# Altium project MCU089B.PrjPcb (part 1 of 4)
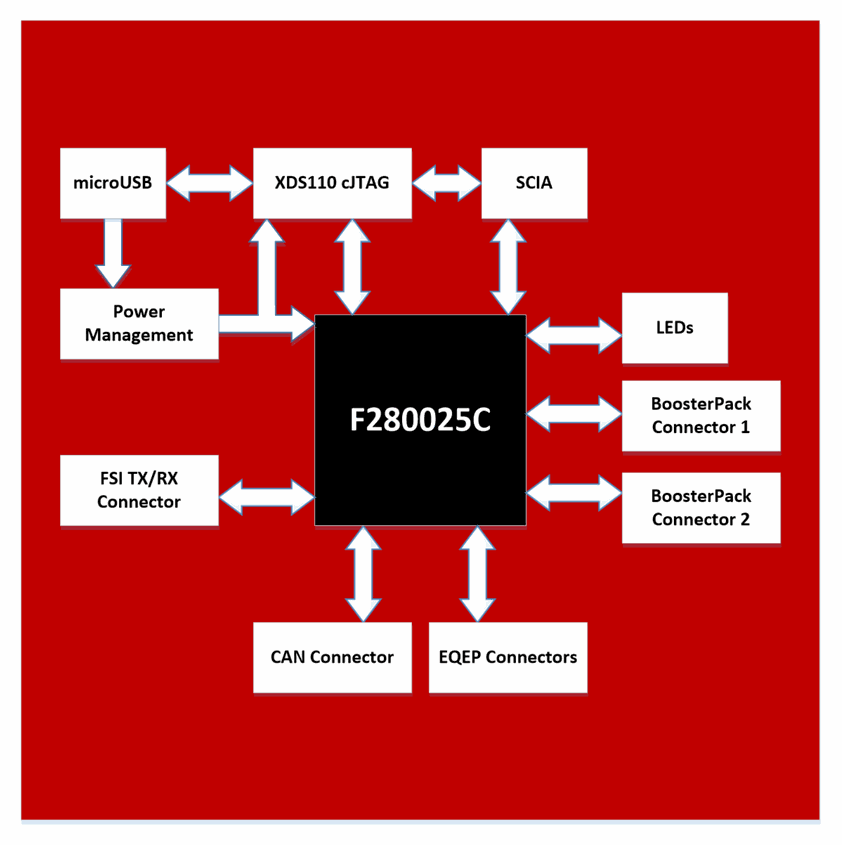
[diagram p0: MCU089B_Block_Diagram.SchDoc]
CopyrightYear: 2022; PCB_Layout: a0232540; PCB_Rev: B; PRJ_Customer: Public Release; PRJ_Engineer: Kevin Allen; PRJ_Number: MCU089; PRJ_Title: LAUNCHXL-F280025C; SCH_Rev: B; TechSupport: http://www.ti.com/support; TID: N/A
7 sheets, 262 parts. Net scope: global (net labels, ports and power ports of the same name join across sheets).
Board file: MCU089B.PcbDoc
Sheets:
  MCU089B_Block_Diagram.SchDoc
  MCU089B_Connectors.SchDoc
  MCU089B_AltRouting_Misc.SchDoc
  MCU089B_F280025C_Device.SchDoc
  MCU089B_XDS110_USB_Power.SchDoc
  MCU089B_XDS110_MCU.SchDoc
  MCU089B_Hardware.SchDoc

## Sheet MCU089B_Block_Diagram.SchDoc
size 431 x 279 mm; Date: Not shown in title block; ApprovedBy: Not shown in title block; CheckedBy: Not shown in title block; Author: Not shown in title block; CompanyName: Not shown in title block; Engineer: Not shown in title block; Organization: Not shown in title block; Address1: Not shown in title block; Address2: Not shown in title block; Address3: Not shown in title block; Address4: Not shown in title block; DocumentNumber: 1; Revision: Use project parameter SCH_Rev; SheetNumber: 1; SheetTotal: 8; PageSetup: Record=PageOptions|CenterHorizontal=True|CenterVertical=True|PrintScale=1.00|XCorrection=1.00|YCorrection=1.00|PrintKind=0|BorderSize=5000000|LeftOffset=0|BottomOffset=0|Orientation=2|PaperLength=1000|PaperWidth=1000|Scale=100|PaperSource=15|PrintQuality=600|MediaType=1|DitherType=10|PaperKind=Letter|PrintScaleMode=1; CurrentTime: Not shown in title block; CurrentDate: Not shown in title block; Time: Not shown in title block; DocumentFullPathAndName: Not shown in title block; DocumentName: Not shown in title block; ModifiedDate: Not shown in title block; ImagePath: Not shown in title block

### Notes on the sheet
- Drawn By:
- SVN Rev:
- Number:
- TID #:
- Orderable:
- Rev:
- Sheet Title:
- File:
- Project Title:
- Designed for:
- Assembly Variant:
- Mod. Date:
- Sheet:
- Size:
- of
- B
- http://www.ti.com
- Texas Instruments and/or its licensors do not warrant the accuracy or completeness of this specification or any information contained therein. Texas Instruments and/or its licensors do not warrant that this design will meet the specifications, will be suitable for your application or fit for any particular purpose, or will operate in an implementation. Texas Instruments and/or its licensors do not warrant that the design is production worthy. You should completely validate and test your design implementation to confirm the system functionality for your application.
- Engineer:
- Contact:
- © Texas Instruments

## Sheet MCU089B_Connectors.SchDoc
size 431 x 279 mm; Date: Not shown in title block; ApprovedBy: Not shown in title block; CheckedBy: Not shown in title block; Author: Not shown in title block; CompanyName: Not shown in title block; Engineer: Not shown in title block; Organization: Not shown in title block; Address1: Not shown in title block; Address2: Not shown in title block; Address3: Not shown in title block; Address4: Not shown in title block; DocumentNumber: 2; Revision: Use project parameter SCH_Rev; SheetNumber: 2; SheetTotal: 8; PageSetup: Record=PageOptions|CenterHorizontal=True|CenterVertical=True|PrintScale=1.00|XCorrection=1.00|YCorrection=1.00|PrintKind=0|BorderSize=5000000|LeftOffset=0|BottomOffset=0|Orientation=2|PaperLength=1000|PaperWidth=1000|Scale=100|PaperSource=15|PrintQuality=600|MediaType=1|DitherType=10|PaperKind=Letter|PrintScaleMode=1; CurrentTime: Not shown in title block; CurrentDate: Not shown in title block; Time: Not shown in title block; DocumentFullPathAndName: Not shown in title block; DocumentName: Not shown in title block; ModifiedDate: Not shown in title block; ImagePath: Not shown in title block
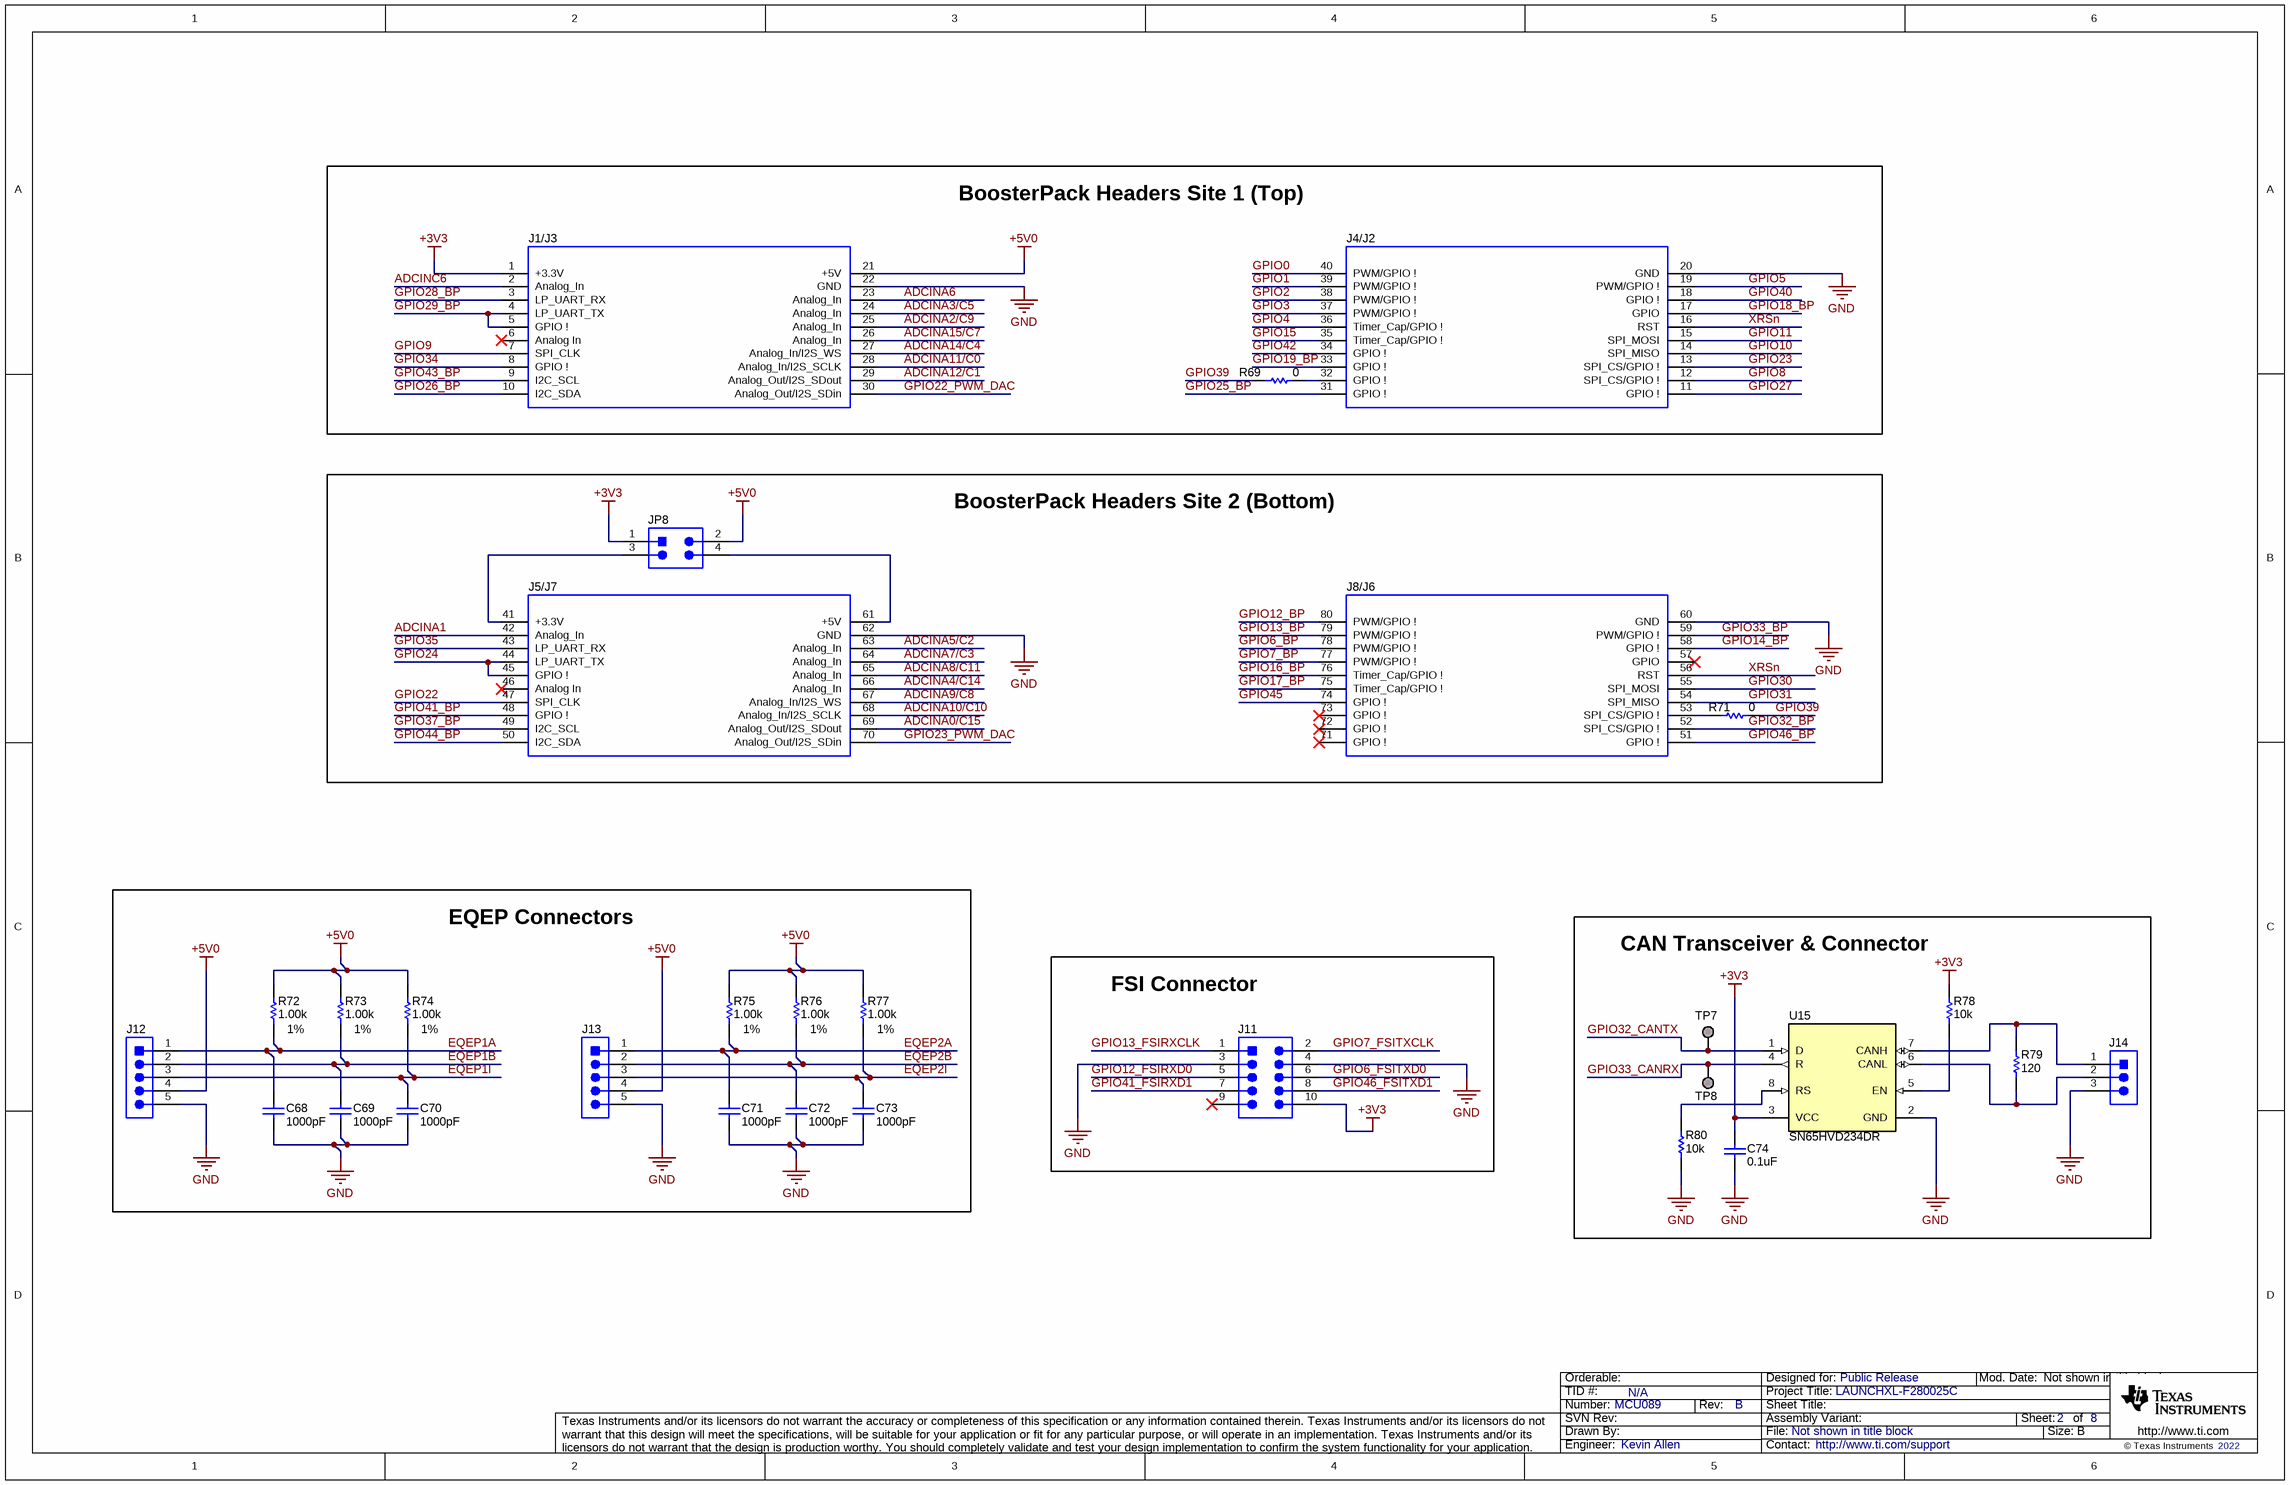
[diagram p1: MCU089B_Connectors.SchDoc]

### Parts
C68  ValueDisplayed: 1000pF  [0402]  (hidden comment: 885012205061)
C69  ValueDisplayed: 1000pF  [0402]  (hidden comment: 885012205061)
C70  ValueDisplayed: 1000pF  [0402]  (hidden comment: 885012205061)
C71  ValueDisplayed: 1000pF  [0402]  (hidden comment: 885012205061)
C72  ValueDisplayed: 1000pF  [0402]  (hidden comment: 885012205061)
C73  ValueDisplayed: 1000pF  [0402]  (hidden comment: 885012205061)
C74  ValueDisplayed: 0.1uF  [0402]  (hidden comment: GRM155R71A104KA01D)
J1/J3  SSQ-110-03-T-D  [BoosterPack_40pin_J1J3]  (value not drawn)
J4/J2  SSQ-110-03-T-D  [BoosterPack_40pin_J2J4]  (value not drawn)
J5/J7  SSQ-110-03-T-D  [BoosterPack_40pin_J5J7]  (value not drawn)
J8/J6  SSQ-110-03-T-D  [BoosterPack_40pin_J6J8]  (value not drawn)
J11  TSW-105-07-G-D  [TSW-105-07-G-D]  (value not drawn)
J12  TSW-105-07-G-S  [TSW-105-07-X-S]  (value not drawn)
J13  TSW-105-07-G-S  [TSW-105-07-X-S]  (value not drawn)
J14  61300311121  [WURTH_61300311121]  (value not drawn)
JP8  TSW-102-07-G-D  [TSW-102-07-G-D]  (value not drawn)
R69  ValueDisplayed: 0  [0603]  (hidden comment: CRCW06030000Z0EA)
R71  ValueDisplayed: 0  [0603]  (hidden comment: CRCW06030000Z0EA)
R72  ValueDisplayed: 1.00k  Value1: 1%  [0402]  (hidden comment: CRCW04021K00FKED)
R73  ValueDisplayed: 1.00k  Value1: 1%  [0402]  (hidden comment: CRCW04021K00FKED)
R74  ValueDisplayed: 1.00k  Value1: 1%  [0402]  (hidden comment: CRCW04021K00FKED)
R75  ValueDisplayed: 1.00k  Value1: 1%  [0402]  (hidden comment: CRCW04021K00FKED)
R76  ValueDisplayed: 1.00k  Value1: 1%  [0402]  (hidden comment: CRCW04021K00FKED)
R77  ValueDisplayed: 1.00k  Value1: 1%  [0402]  (hidden comment: CRCW04021K00FKED)
R78  ValueDisplayed: 10k  [0402]  (hidden comment: CRCW040210K0JNED)
R79  ValueDisplayed: 120  [0603]  (hidden comment: RC0603FR-07120RL)
R80  ValueDisplayed: 10k  [0402]  (hidden comment: CRCW040210K0JNED)
TP7  TESTPOINT  [TP_50MIL-25MILHOLE]  (value not drawn)  (no BOM)
TP8  TESTPOINT  [TP_50MIL-25MILHOLE]  (value not drawn)  (no BOM)
U15  SN65HVD234DR  [D0008A_L]

### Blocks framed on the sheet
BoosterPack Headers Site 1 (Top): J1/J3 J4/J2 R69
BoosterPack Headers Site 2 (Bottom): J5/J7 J8/J6 JP8 R71
EQEP Connectors: C68-C73 J12 J13 R72-R77
FSI Connector: J11
CAN Transceiver & Connector: C74 J14 R78-R80 TP7 TP8 U15

### Nets
+3V3: C74.2 J1/J3.1(+3.3V) J11.10 JP8.1 R78.2 U15.3(VCC)
+5V0: J1/J3.21(+5V) J12.4 J13.4 JP8.2 R72.2 R73.2 R74.2 R75.2 R76.2 R77.2
GND: C68.2 C69.2 C70.2 C71.2 C72.2 C73.2 C74.1 J1/J3.22(GND) J4/J2.20(GND) J5/J7.62(GND) J8/J6.60(GND) J11.3 J11.4 J12.5 J13.5 J14.3 R80.1 U15.2(GND)
ADCINA0/C15: J5/J7.69(Analog_Out/I2S_SDout)
ADCINA1: J5/J7.42(Analog_In)
ADCINA2/C9: J1/J3.25(Analog_In)
ADCINA3/C5: J1/J3.24(Analog_In)
ADCINA4/C14: J5/J7.66(Analog_In)
ADCINA5/C2: J5/J7.63(Analog_In)
ADCINA6: J1/J3.23(Analog_In)
ADCINA7/C3: J5/J7.64(Analog_In)
ADCINA8/C11: J5/J7.65(Analog_In)
ADCINA9/C8: J5/J7.67(Analog_In/I2S_WS)
ADCINA10/C10: J5/J7.68(Analog_In/I2S_SCLK)
ADCINA11/C0: J1/J3.28(Analog_In/I2S_SCLK)
ADCINA12/C1: J1/J3.29(Analog_Out/I2S_SDout)
ADCINA14/C4: J1/J3.27(Analog_In/I2S_WS)
ADCINA15/C7: J1/J3.26(Analog_In)
ADCINC6: J1/J3.2(Analog_In)
EQEP1A: C68.1 J12.1 R72.1
EQEP1B: C69.1 J12.2 R73.1
EQEP1I: C70.1 J12.3 R74.1
EQEP2A: C71.1 J13.1 R75.1
EQEP2B: C72.1 J13.2 R76.1
EQEP2I: C73.1 J13.3 R77.1
GPIO0: J4/J2.40(PWM/GPIO_!)
GPIO1: J4/J2.39(PWM/GPIO_!)
GPIO2: J4/J2.38(PWM/GPIO_!)
GPIO3: J4/J2.37(PWM/GPIO_!)
GPIO4: J4/J2.36(Timer_Cap/GPIO_!)
GPIO5: J4/J2.19(PWM/GPIO_!)
GPIO6_BP: J8/J6.78(PWM/GPIO_!)
GPIO6_FSITXD0: J11.6
GPIO7_BP: J8/J6.77(PWM/GPIO_!)
GPIO7_FSITXCLK: J11.2
GPIO8: J4/J2.12(SPI_CS/GPIO_!)
GPIO9: J1/J3.7(SPI_CLK)
GPIO10: J4/J2.14(SPI_MISO)
GPIO11: J4/J2.15(SPI_MOSI)
GPIO12_BP: J8/J6.80(PWM/GPIO_!)
GPIO12_FSIRXD0: J11.5
GPIO13_BP: J8/J6.79(PWM/GPIO_!)
GPIO13_FSIRXCLK: J11.1
GPIO14_BP: J8/J6.58(GPIO_!)
GPIO15: J4/J2.35(Timer_Cap/GPIO_!)
GPIO16_BP: J8/J6.76(Timer_Cap/GPIO_!)
GPIO17_BP: J8/J6.75(Timer_Cap/GPIO_!)
GPIO18_BP: J4/J2.17(GPIO)
GPIO19_BP: J4/J2.33(GPIO_!)
GPIO22: J5/J7.47(SPI_CLK)
GPIO22_PWM_DAC: J1/J3.30(Analog_Out/I2S_SDin)
GPIO23: J4/J2.13(SPI_CS/GPIO_!)
GPIO23_PWM_DAC: J5/J7.70(Analog_Out/I2S_SDin)
GPIO24: J5/J7.44(LP_UART_TX) J5/J7.45(GPIO_!)
GPIO25_BP: J4/J2.31(GPIO_!)
GPIO26_BP: J1/J3.10(I2C_SDA)
GPIO27: J4/J2.11(GPIO_!)
GPIO28_BP: J1/J3.3(LP_UART_RX)
GPIO29_BP: J1/J3.4(LP_UART_TX) J1/J3.5(GPIO_!)
GPIO30: J8/J6.55(SPI_MOSI)
GPIO31: J8/J6.54(SPI_MISO)
GPIO32_BP: J8/J6.52(SPI_CS/GPIO_!)
GPIO32_CANTX: TP7.1 U15.1(D)
GPIO33_BP: J8/J6.59(PWM/GPIO_!)
GPIO33_CANRX: TP8.1 U15.4(R)
GPIO34: J1/J3.8(GPIO_!)
GPIO35: J5/J7.43(LP_UART_RX)
GPIO37_BP: J5/J7.49(I2C_SCL)
GPIO39: R69.1 R71.2
GPIO40: J4/J2.18(GPIO_!)
GPIO41_BP: J5/J7.48(GPIO_!)
GPIO41_FSIRXD1: J11.7
GPIO42: J4/J2.34(GPIO_!)
GPIO43_BP: J1/J3.9(I2C_SCL)
GPIO44_BP: J5/J7.50(I2C_SDA)
GPIO45: J8/J6.74(GPIO_!)
GPIO46_BP: J8/J6.51(GPIO_!)
GPIO46_FSITXD1: J11.8
XRSn: J4/J2.16(RST) J8/J6.56(RST)
NetJ4/J2_32: J4/J2.32(GPIO_!) R69.2
NetJ5/J7_41: J5/J7.41(+3.3V) JP8.3
NetJ5/J7_61: J5/J7.61(+5V) JP8.4
NetJ8/J6_53: J8/J6.53(SPI_CS/GPIO_!) R71.1
NetJ14_1: J14.1 R79.2 U15.7(CANH)
NetJ14_2: J14.2 R79.1 U15.6(CANL)
NetR78_1: R78.1 U15.5(EN)
NetR80_2: R80.2 U15.8(RS)

Not connected (* = marked no-connect by the designer): J1/J3 6(Analog_In)*; J5/J7 46(Analog_In)*; J8/J6 57(GPIO)* 71(GPIO_!)* 72(GPIO_!)* 73(GPIO_!)*; J11 9*

### Notes on the sheet
- Drawn By:
- SVN Rev:
- Number:
- TID #:
- Orderable:
- Rev:
- Sheet Title:
- File:
- Project Title:
- Designed for:
- Assembly Variant:
- Mod. Date:
- Sheet:
- Size:
- of
- B
- http://www.ti.com
- Texas Instruments and/or its licensors do not warrant the accuracy or completeness of this specification or any information contained therein. Texas Instruments and/or its licensors do not warrant that this design will meet the specifications, will be suitable for your application or fit for any particular purpose, or will operate in an implementation. Texas Instruments and/or its licensors do not warrant that the design is production worthy. You should completely validate and test your design implementation to confirm the system functionality for your application.
- Engineer:
- Contact:
- © Texas Instruments

### Library data of the parts
C68-C73 = CMP-0006231-2: CAP, CERM, 1000 pF, 50 V, +/- 10%, X7R, 0402; Manufacturer: Wurth Elektronik; Polarized: N; Value: 1000pF; U/M: EA; Cap_F: 1nF; Value1: Unknown; VDC_V: 50V; TaMin_C: -55°C; TaMax_C: 125°C; SizeArea_mm2: 0.5; SizeAreaWB_mm2: 3; SizeX_mm: 1; SizeZ_mm: 0.6; AEC Category: Q200; CompType: Capacitor; PartNumber: 885012205061; PackageReference: 0402; RoHS: Y; Tolerance_%: 10%; Value2: 50V; MountType: SMT; Technology: Ceramic; TempCo: X7R; Cap_Case: 0402; SizeY_mm: 0.5; Published: 2008-06-19; Publisher: Texas Instruments; LatestRevisionDate: 2017-03-09; ComponentLink1Description: Datasheet link; ComponentLink1URL: http://katalog.we-online.de/pbs/datasheet/885012205061.pdf; Supplier 1: Digi-Key; Supplier Part Number 1: 732-7556-1-ND; Supplier 2: Mouser; Supplier Part Number 2: 710-885012205061; AEC Qualified: N; AEC Grade: N/A
C74 = CMP-0006629-2: CAP, CERM, 0.1 uF, 10 V, +/- 10%, X7R, 0402; Manufacturer: MuRata; Polarized: N; Value: 0.1uF; U/M: EA; Cap_F: 100nF; Value1: Unknown; VDC_V: 10V; TaMin_C: -55°C; TaMax_C: 125°C; SizeArea_mm2: 0.5; SizeAreaWB_mm2: 3; SizeX_mm: 1; SizeZ_mm: 0.6; AEC Category: Q200; CompType: Capacitor; PartNumber: GRM155R71A104KA01D; PackageReference: 0402; RoHS: Y; Tolerance_%: 10%; Value2: 10V; MountType: SMT; Technology: Ceramic; TempCo: X7R; Cap_Case: 0402; SizeY_mm: 0.5; Published: 2008-06-19; Publisher: Texas Instruments; LatestRevisionDate: 2017-03-09; ComponentLink1Description: Datasheet link; ComponentLink1URL: http://search.murata.co.jp/Ceramy/PnsearchViewAction.do?HnOFG=ON&HnNFG=ON&SEL_CNT=50&sLang=en&sKey=GRM155R71A104KA01D&x=9&y=9&search=startwith; Supplier 1: Digi-Key; Supplier Part Number 1: GRM155R71A104KA01D-ND; Supplier 2: Newark; Supplier Part Number 2: 14T3278; Supplier 3: Mouser; Supplier Part Number 3: 81-GRM155R71A104KA1D; AEC Qualified: ?
J1/J3 = CMP-0003837-4: Receptacle, 2.54mm, 10x2, Tin, TH; Alternate PartNumber: CRD-081413-A-G; Manufacturer: Samtec; Alternate Manufacturer: Major League Electronics; Note: Booster Pack 40 pin J1 and J3; Green_Lifecycle: Active; Green_REACh: Incomplete; Supplier 1: Digi-Key; CompType: Receptacle; PackageReference: 10x2 Receptacle; RoHS: Y; Supplier Part Number 1: SAM1204-10-ND; MountType: TH; PartNumber: SSQ-110-03-T-D; ComponentLink1Description: Datasheet Link; ComponentLink1URL: https://www.samtec.com/ftppub/cpdf/SSQ-1XX-XX-XXX-X-XX-XXX-XX-X-MKT.pdf; Supplier 2: Newark; Supplier Part Number 2: 11P8392; Green_EU RoHS: Passed; Green_EU RoHS-2: Passed
J4/J2 = CMP-0078266-4: Receptacle, 2.54mm, 10x2, Tin, TH; Alternate PartNumber: CRD-081413-A-G; Manufacturer: Samtec; Alternate Manufacturer: Major League Electronics; Note: Booster Pack 40 pin J2 and J4; Green_REACh: Incomplete; Green_Lifecycle: Active; Green_EU RoHS-2: Passed; CompType: Receptacle; Supplier 1: Digi-Key; PackageReference: 10x2 Receptacle; RoHS: Y; Supplier Part Number 1: SAM1204-10-ND; PartNumber: SSQ-110-03-T-D; MountType: TH; ComponentLink1Description: Datasheet Link; Green_EU RoHS: Passed; ComponentLink1URL: https://www.samtec.com/ftppub/cpdf/SSQ-1XX-XX-XXX-X-XX-XXX-XX-X-MKT.pdf; Supplier 2: Newark; Supplier Part Number 2: 11P8392
J5/J7 = CMP-0081070-3: Receptacle, 2.54mm, 10x2, Tin, TH; Alternate PartNumber: CRD-081413-A-G; Manufacturer: Samtec; Alternate Manufacturer: Major League Electronics; Note: Booster Pack 40 pin J5 and J7; Green_REACh: Incomplete; Green_Lifecycle: Active; ComponentLink1URL: https://www.samtec.com/ftppub/cpdf/SSQ-1XX-XX-XXX-X-XX-XXX-XX-X-MKT.pdf; Green_EU RoHS-2: Passed; CompType: Receptacle; Supplier 1: Digi-Key; PackageReference: 10x2 Receptacle; RoHS: Y; Supplier Part Number 1: SAM1204-10-ND; PartNumber: SSQ-110-03-T-D; MountType: TH; ComponentLink1Description: Datasheet Link; Green_EU RoHS: Passed
J8/J6 = CMP-0081071-3: Receptacle, 2.54mm, 10x2, Tin, TH; Alternate PartNumber: CRD-081413-A-G; Manufacturer: Samtec; Alternate Manufacturer: Major League Electronics; Note: Booster Pack 40 pin J6 and J8; Green_REACh: Incomplete; Green_Lifecycle: Active; ComponentLink1URL: https://www.samtec.com/ftppub/cpdf/SSQ-1XX-XX-XXX-X-XX-XXX-XX-X-MKT.pdf; Green_EU RoHS-2: Passed; CompType: Receptacle; Supplier 1: Digi-Key; PackageReference: 10x2 Receptacle; RoHS: Y; Supplier Part Number 1: SAM1204-10-ND; PartNumber: SSQ-110-03-T-D; MountType: TH; ComponentLink1Description: Datasheet Link; Green_EU RoHS: Passed
J11 = CMP-0075410-2: Header, 100mil, 5x2, Gold, TH; Manufacturer: Samtec; Pitch_mm: 2.54; Cert_VDE: N; Gender: Male; Cert_CSA: Y; Voltage_V: 550V; Green_REACh: Passed; Current_A: 6.3A; Green_Lifecycle: Active; Row_Count: 2; ComponentLink1Description: Datasheet URL; RoHS: Y; Supplier 1: Digi-Key; Cert_UL: Y; Orientation: Vertical; Green_EU RoHS: Passed; PackageReference: 5x2 Header; Color: Black; PartNumber: TSW-105-07-G-D; PinCount: 10; ContactFinish: Gold; Cert_CULUS: N; Shrouded: N; ClassName: Header; RowSpacing_mm: 2.54; ComponentLink1URL: http://samtec.com/ftppub/pdf/TSW_TH.PDF; CompType: Header; MountType: TH; Supplier Part Number 1: SAM1028-05-ND; Green_EU RoHS-2: Passed
J12 J13 = CMP-0075411-1: Header, 100mil, 5x1, Gold, TH; Manufacturer: Samtec; Pitch_mm: 2.54; Cert_VDE: N; Gender: Male; Cert_CSA: Y; Voltage_V: 550V; Green_REACh: Passed; Current_A: 6.3A; CT: False; Green_Lifecycle: Active; Row_Count: 1; CNHeader: True; ComponentLink1Description: Datasheet URL; RoHS: Y; Supplier 1: Digi-Key; Cert_UL: Y; Orientation: Vertical; Green_EU RoHS: Passed; PackageReference: 5x1 Header; Color: Black; PartNumber: TSW-105-07-G-S; PinCount: 5; Publisher: Texas Instruments; ContactFinish: Gold; Cert_CULUS: N; Shrouded: N; ClassName: Header; ComponentLink1URL: http://samtec.com/ftppub/pdf/TSW_TH.PDF; LatestRevisionDate: 2017-07-12; CompType: Header; MountType: TH; Supplier Part Number 1: SAM1029-05-ND; Green_EU RoHS-2: Passed
J14 = CMP-0054796-1: Header, 2.54 mm, 3x1, Gold, TH; Manufacturer: Wurth Elektronik; Green_Lifecycle: Active; Green_REACh: Passed; CNHeader: TRUE; CT: FALSE; PartNumber: 61300311121; PackageReference: Header, 2.54mm, 3x1, TH; ClassName: Header; CompType: Header; RoHS: Y; MountType: TH; ComponentLink1Description: Datasheet URL; ComponentLink1URL: http://katalog.we-online.de/em/datasheet/6130xx11121.pdf; Publisher: Texas Instruments; LatestRevisionDate: 26/05/2017; Supplier 1: Digi-Key; Supplier Part Number 1: 732-5316-ND; Supplier 2: Newark; Supplier Part Number 2: 20X0950; Supplier 3: Farnell; Supplier Part Number 3: 356154; Green_EU RoHS: Passed; Green_EU RoHS-2: Incomplete
JP8 = CMP-0075404-1: Header, 100mil, 2x2, Gold, TH; Manufacturer: Samtec; CNHeader: True; Shrouded: N; Gender: Male; Row_Count: 2; RowSpacing_mm: 2.54; CT: False; Cert_CSA: Y; Current_A: 6.3A; Green_Lifecycle: Active; Green_REACh: Passed; Voltage_V: 550V; ComponentLink1URL: http://samtec.com/ftppub/pdf/TSW_TH.PDF; ClassName: Header; Publisher: Texas Instruments; Color: Black; RoHS: Y; MountType: TH; Supplier 1: Digi-Key; PackageReference: 2x2 Header; PinCount: 4; CompType: Header; LatestRevisionDate: 2017-07-12; PartNumber: TSW-102-07-G-D; Orientation: Vertical; ComponentLink1Description: Datasheet URL; Supplier Part Number 1: SAM1028-02-ND; Pitch_mm: 2.54; ContactFinish: Gold; Cert_CULUS: N; Cert_UL: Y; Cert_VDE: N; Green_EU RoHS: Passed; Green_EU RoHS-2: Passed
R69 R71 = CMP-0025697-4: RES, 0, 5%, 0.1 W, AEC-Q200 Grade 0, 0603; Manufacturer: Vishay-Dale; Value: 0; Value_Code: 0000; Power_W: 100mW; Value2: 0.1W; VDC_V: 75V; TempCo: 200 ppm/C; SizeArea_mm2: 1.28; SizeX_mm: 1.6; SizeY_mm: 0.8; SizeZ_mm: 1; EIA_Code: E24; AEC Category: Q200; AEC Qualified: Y; CompType: Resistor; PartNumber: CRCW06030000Z0EA; PackageReference: 0603; RoHS: E; Res_ohm: 0; Tolerance_%: 5%; Value1: 5%; MountType: SMT; Technology: Thick Film; ComponentLink1Description: Datasheet link; ComponentLink1URL: http://www.vishay.com/docs/20035/dcrcwe3.pdf; Supplier 1: Digi-Key; Supplier Part Number 1: 541-0.0GCT-ND; Supplier 2: Newark; Supplier Part Number 2: 52K8014; Supplier 3: Mouser; Supplier Part Number 3: 71-CRCW0603-0-E3; AEC Grade: 0
R72-R77 = CMP-0026071-3: RES, 1.00 k, 1%, 0.063 W, AEC-Q200 Grade 0, 0402; Manufacturer: Vishay-Dale; Value: 1.00k; Res_ohm: 1k; Value_Code: 1k00; Power_W: 63mW; Value2: 0.063W; VDC_V: 50V; TempCo: 100 ppm/C; SizeArea_mm2: 0.5; SizeX_mm: 1; SizeZ_mm: 0.6; EIA_Code: E96; AEC Category: Q200; AEC Qualified: Y; AEC Grade: 0; CompType: Resistor; PartNumber: CRCW04021K00FKED; PackageReference: 0402; RoHS: E; Tolerance_%: 1%; MountType: SMT; Technology: Thick Film; SizeY_mm: 0.5; ComponentLink1Description: Datasheet link; ComponentLink1URL: http://www.vishay.com/docs/20035/dcrcwe3.pdf; Supplier 1: Digi-Key; Supplier Part Number 1: 541-1.00KLCT-ND; Supplier 2: Newark; Supplier Part Number 2: 52K6545; Supplier 3: Mouser; Supplier Part Number 3: 71-CRCW0402-1.0K-E3
R78 R80 = CMP-0026825-5: RES, 10 k, 5%, 0.063 W, AEC-Q200 Grade 0, 0402; Manufacturer: Vishay-Dale; Value: 10k; Value_Code: 10k0; Power_W: 63mW; Value2: 0.063W; VDC_V: 50V; TempCo: 200 ppm/C; SizeArea_mm2: 0.5; SizeX_mm: 1; SizeZ_mm: 0.6; EIA_Code: E24; AEC Category: Q200; AEC Qualified: Y; AEC Grade: 0; CompType: Resistor; PartNumber: CRCW040210K0JNED; PackageReference: 0402; RoHS: E; Res_ohm: 10k; Tolerance_%: 5%; Value1: 5%; MountType: SMT; Technology: Thick Film; SizeY_mm: 0.5; ComponentLink1Description: Datasheet link; ComponentLink1URL: http://www.vishay.com/docs/20035/dcrcwe3.pdf; Supplier 1: Digi-Key; Supplier Part Number 1: 541-10KJCT-ND; Supplier 2: Newark; Supplier Part Number 2: 59M6696; Supplier 3: Mouser; Supplier Part Number 3: 71-CRCW0402J-10K-E3
R79 = CMP-0022769-3: RES, 120, 1%, 0.1 W, 0603; Manufacturer: Yageo America; Value: 120; Value_Code: 120R; Power_W: 100mW; Value2: 0.1W; VDC_V: 150V; TempCo: 200 ppm/C; SizeArea_mm2: 1.28; SizeX_mm: 1.6; SizeY_mm: 0.8; SizeZ_mm: 1; U/M: EA; AEC Category: Q200; CompType: Resistor; PartNumber: RC0603FR-07120RL; PackageReference: 0603; RoHS: Y; Res_ohm: 120; Tolerance_%: 1%; Value1: 1%; MountType: SMT; Technology: Thick Film; Published: 2008-06-26; Publisher: Texas Instruments; LatestRevisionDate: 2017-03-09; ComponentLink1Description: Datasheet link; ComponentLink1URL: http://www.yageo.com/pdf/Pu-RC0603_51_PbFree_L_2.pdf; Supplier 1: Digi-Key; Supplier Part Number 1: 311-120HRCT-ND; Supplier 2: Mouser; Supplier Part Number 2: 603-RC0603FR-07120RL; Supplier 3: Farnell; Supplier Part Number 3: 9238379; AEC Qualified: ?
TP7 TP8 = CMP-0078143-3: TEST POINT.  No entry in BOM.; CompType: Testpoint; PackageReference: N/A; Manufacturer: N/A; PartNumber: N/A; Library Reference: TESTPOINT
U15 = CMP-0033355-1: 3.3V CAN Transceiver with Sleep Mode, 6 mA, -40 to 125 degC, 8-pin SOIC (D), Green (RoHS & no Sb/Br); Manufacturer: Texas Instruments; Drivers Per Package: 1; Bus Fault Voltage(V): +/-30; Transient Pulse Protection(V): -100 to 100; ICC(Max)(mA): 6; Supply Voltage(s)(V): 3.3; Rating: Catalog; DatasheetVersion: SLLS557F; PackageVersion: revM, Jun-2011; PackageReference: D0008A; PackageDescription: 8-Pin Plastic Small Outline Integrated Circuit, 4.9 x 3.9 mm, Pitch 1.27 mm Pitch; Eco-Plan: Green (RoHS & no Sb/Br); SubFamily: CAN; Receivers Per Package: 1; Isolated: No; Low Power Mode: Sleep; Footprint: PCA82C250, excludes pin5; PartNumber: SN65HVD234DR; Code_JEDEC: MS-012AA; ComponentLink1Description: Datasheet; ComponentLink1URL: http://www.ti.com/general/docs/lit/getliterature.tsp?genericPartNumber=SN65HVD234&fileType=pdf; Mounting Technology: Surface Mount

## Sheet MCU089B_AltRouting_Misc.SchDoc
size 431 x 279 mm; Date: Not shown in title block; ApprovedBy: Not shown in title block; CheckedBy: Not shown in title block; Author: Not shown in title block; CompanyName: Not shown in title block; Engineer: Not shown in title block; Organization: Not shown in title block; Address1: Not shown in title block; Address2: Not shown in title block; Address3: Not shown in title block; Address4: Not shown in title block; DocumentNumber: 3; Revision: Use project parameter SCH_Rev; SheetNumber: 3; SheetTotal: 8; PageSetup: Record=PageOptions|CenterHorizontal=True|CenterVertical=True|PrintScale=1.00|XCorrection=1.00|YCorrection=1.00|PrintKind=0|BorderSize=5000000|LeftOffset=0|BottomOffset=0|Orientation=2|PaperLength=1000|PaperWidth=1000|Scale=100|PaperSource=15|PrintQuality=600|MediaType=1|DitherType=10|PaperKind=Letter|PrintScaleMode=1; CurrentTime: Not shown in title block; CurrentDate: Not shown in title block; Time: Not shown in title block; DocumentFullPathAndName: Not shown in title block; DocumentName: Not shown in title block; ModifiedDate: Not shown in title block; ImagePath: Not shown in title block
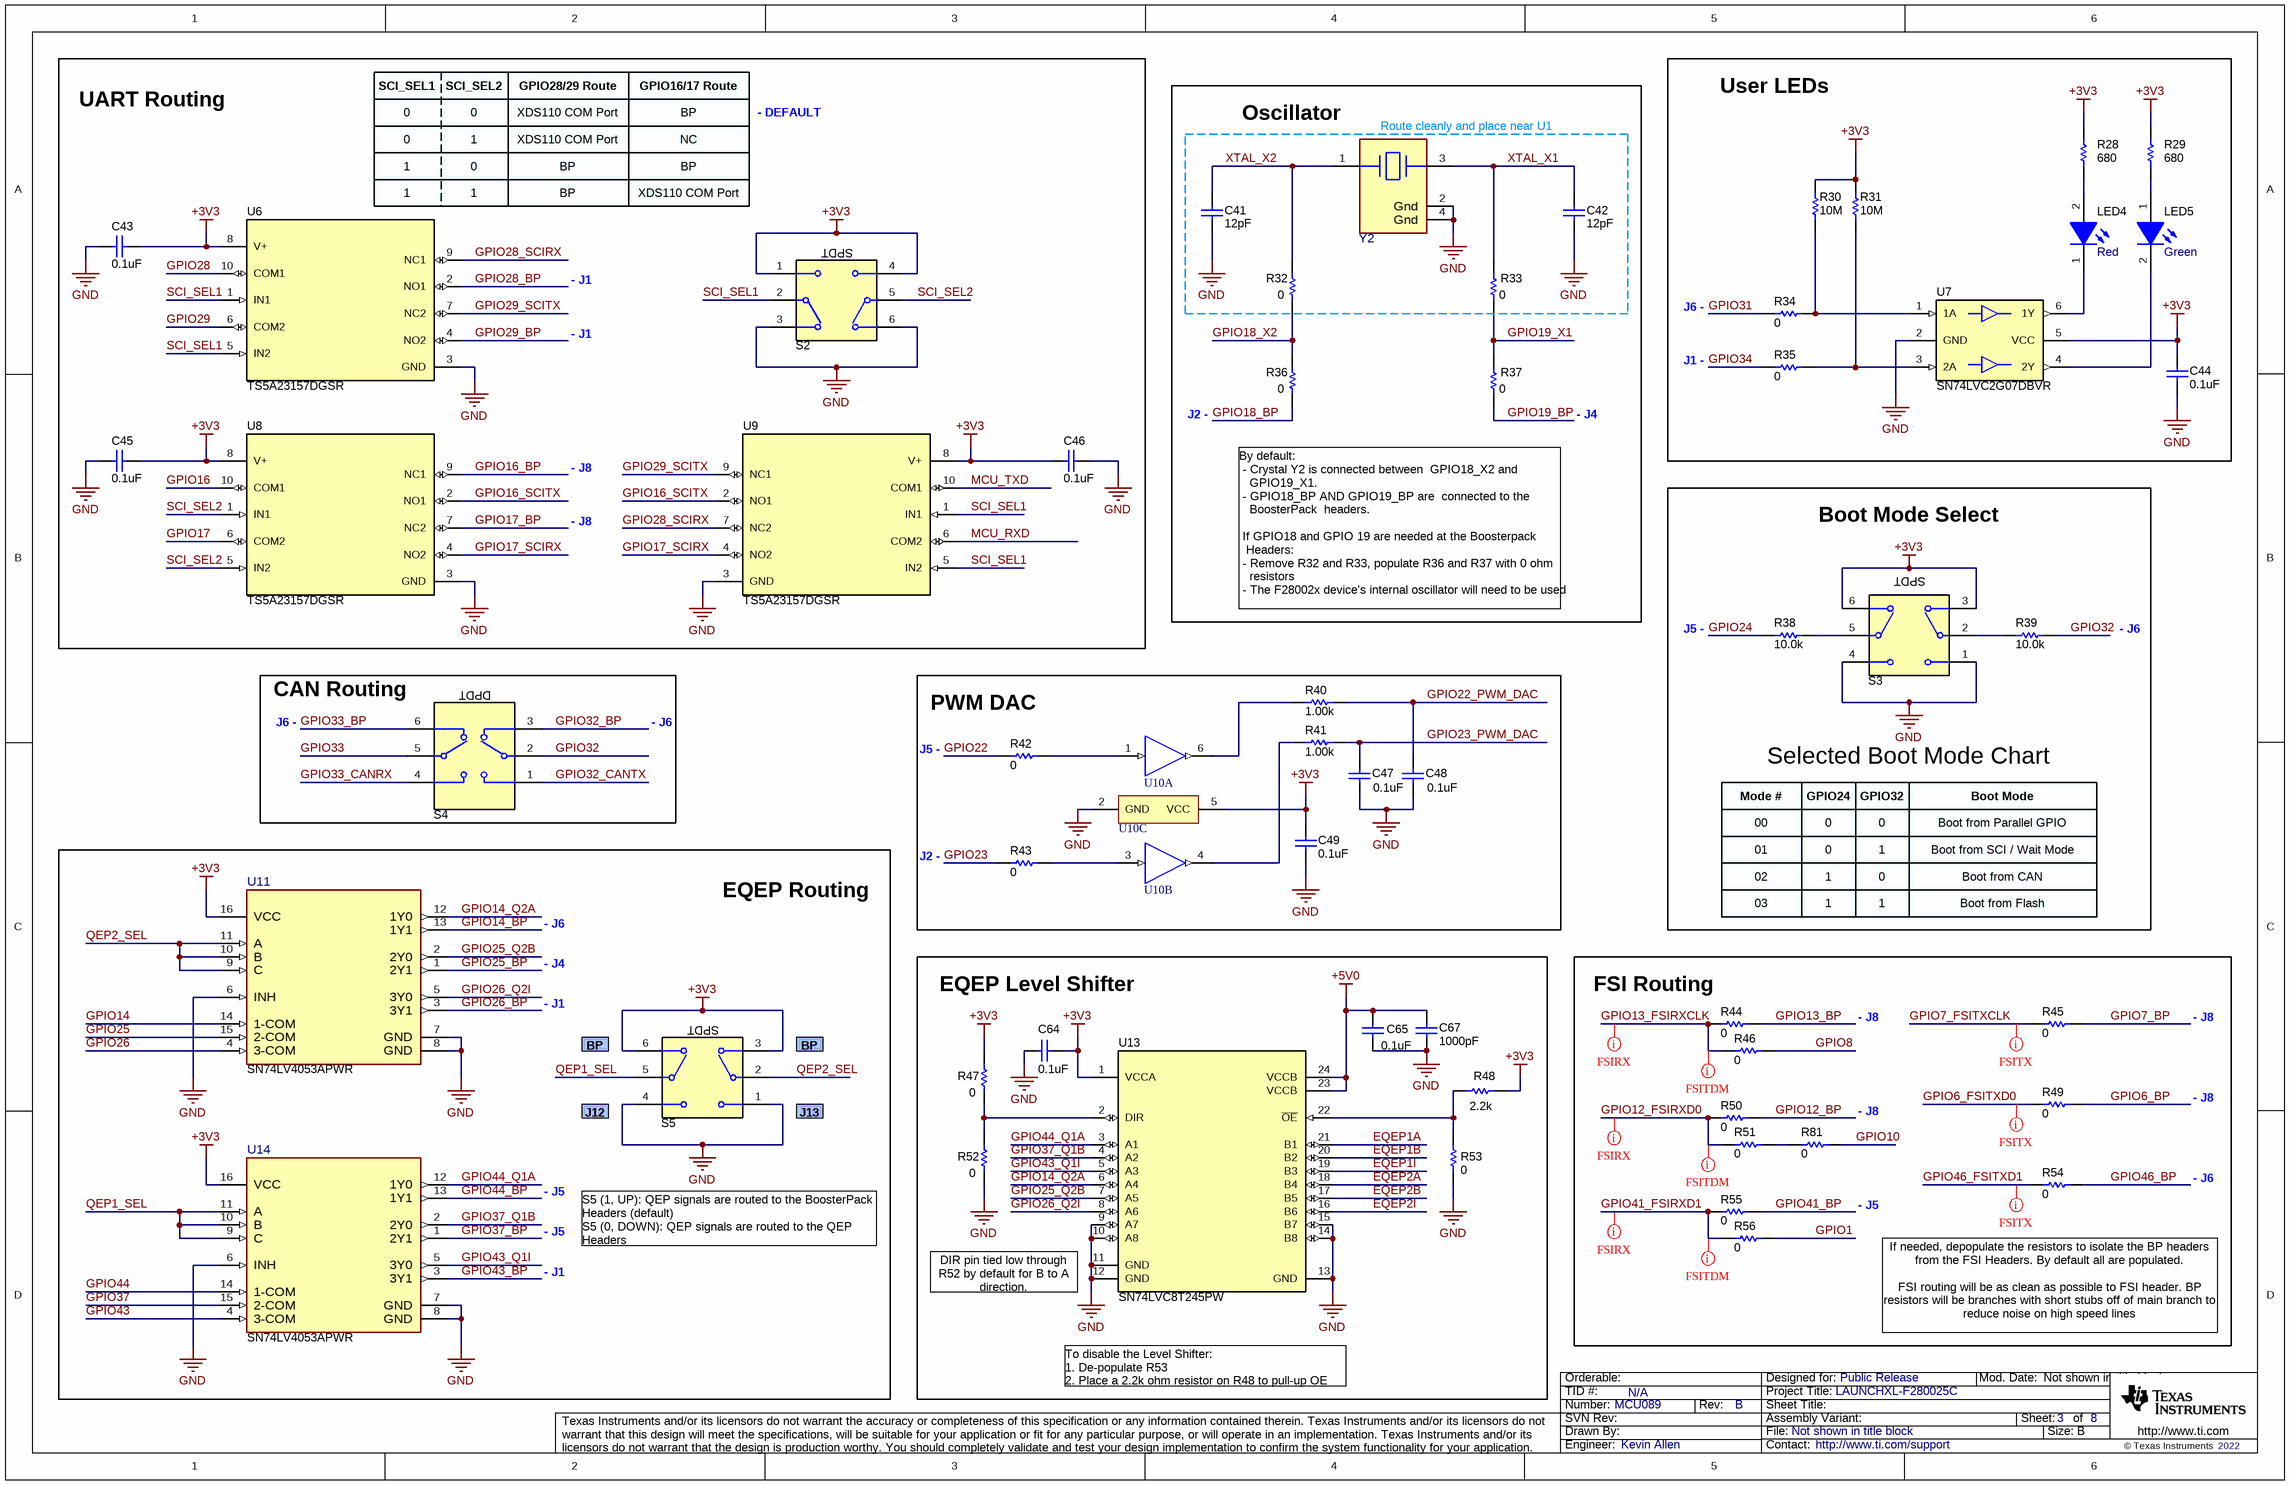
[diagram p2: MCU089B_AltRouting_Misc.SchDoc]

### Parts
C41  ValueDisplayed: 12pF  [0402]  (hidden comment: C0402C120J3GACAUTO)
C42  ValueDisplayed: 12pF  [0402]  (hidden comment: C0402C120J3GACAUTO)
C43  ValueDisplayed: 0.1uF  [0402]  (hidden comment: GRM155R71A104KA01D)
C44  ValueDisplayed: 0.1uF  [0402]  (hidden comment: GRM155R71A104KA01D)
C45  ValueDisplayed: 0.1uF  [0402]  (hidden comment: GRM155R71A104KA01D)
C46  ValueDisplayed: 0.1uF  [0402]  (hidden comment: GRM155R71A104KA01D)
C47  ValueDisplayed: 0.1uF  [0402]  (hidden comment: TMK105B7104MV-FR)
C48  ValueDisplayed: 0.1uF  [0402]  (hidden comment: TMK105B7104MV-FR)
C49  ValueDisplayed: 0.1uF  [0402]  (hidden comment: GRM155R71A104KA01D)
C64  ValueDisplayed: 0.1uF  [0402]  (hidden comment: GRM155R71A104KA01D)
C65  ValueDisplayed: 0.1uF  [0402]  (hidden comment: GRM155R71A104KA01D)
C67  ValueDisplayed: 1000pF  [0402]  (hidden comment: 885012205061)
LED4  value Red  [WL-SMCW_RED_0805]  (hidden comment: 150080SS75000)
LED5  value Green  [LED_LTST-C171]  (hidden comment: LTST-C171GKT)
R28  ValueDisplayed: 680  [0402]  (hidden comment: CRCW0402680RJNED)
R29  ValueDisplayed: 680  [0402]  (hidden comment: CRCW0402680RJNED)
R30  ValueDisplayed: 10M  [0402]  (hidden comment: CRCW040210M0JNED)
R31  ValueDisplayed: 10M  [0402]  (hidden comment: CRCW040210M0JNED)
R32  ValueDisplayed: 0  [0603]  (hidden comment: CRCW06030000Z0EA)
R33  ValueDisplayed: 0  [0603]  (hidden comment: CRCW06030000Z0EA)
R34  ValueDisplayed: 0  [0603]  (hidden comment: CRCW06030000Z0EA)
R35  ValueDisplayed: 0  [0603]  (hidden comment: CRCW06030000Z0EA)
R36  ValueDisplayed: 0  [0603]  (hidden comment: CRCW06030000Z0EA)
R37  ValueDisplayed: 0  [0603]  (hidden comment: CRCW06030000Z0EA)
R38  ValueDisplayed: 10.0k  [0603]  (hidden comment: RC0603FR-0710KL)
R39  ValueDisplayed: 10.0k  [0603]  (hidden comment: RC0603FR-0710KL)
R40  ValueDisplayed: 1.00k  [0402]  (hidden comment: CRCW04021K00FKED)
R41  ValueDisplayed: 1.00k  [0402]  (hidden comment: CRCW04021K00FKED)
R42  ValueDisplayed: 0  [0603]  (hidden comment: CRCW06030000Z0EA)
R43  ValueDisplayed: 0  [0603]  (hidden comment: CRCW06030000Z0EA)
R44  ValueDisplayed: 0  [0603]  (hidden comment: CRCW06030000Z0EA)
R45  ValueDisplayed: 0  [0603]  (hidden comment: CRCW06030000Z0EA)
R46  ValueDisplayed: 0  [0603]  (hidden comment: CRCW06030000Z0EA)
R47  ValueDisplayed: 0  [0603]  (hidden comment: CRCW06030000Z0EA)
R48  ValueDisplayed: 2.2k  [0603]  (hidden comment: CRCW06032K20JNEA)
R49  ValueDisplayed: 0  [0603]  (hidden comment: CRCW06030000Z0EA)
R50  ValueDisplayed: 0  [0603]  (hidden comment: CRCW06030000Z0EA)
R51  ValueDisplayed: 0  [0603]  (hidden comment: CRCW06030000Z0EA)
R52  ValueDisplayed: 0  [0603]  (hidden comment: CRCW06030000Z0EA)
R53  ValueDisplayed: 0  [0603]  (hidden comment: CRCW06030000Z0EA)
R54  ValueDisplayed: 0  [0603]  (hidden comment: CRCW06030000Z0EA)
R55  ValueDisplayed: 0  [0603]  (hidden comment: CRCW06030000Z0EA)
R56  ValueDisplayed: 0  [0603]  (hidden comment: CRCW06030000Z0EA)
R81  ValueDisplayed: 0  [0603]  (hidden comment: CRCW06030000Z0EA)
S2  CAS-D20TA  [SW_CAS-D20TA]  (value not drawn)
S3  CAS-D20TA  [SW_CAS-D20TA]  (value not drawn)
S4  CAS-220TA  [SW_CAS-220TA]  (value not drawn)
S5  CAS-D20TA  [SW_CAS-D20TA]  (value not drawn)
U6  TS5A23157DGSR  [DGS0010A_N]
U7  SN74LVC2G07DBVR  [DBV0006A_N]
U8  TS5A23157DGSR  [DGS0010A_N]
U9  TS5A23157DGSR  [DGS0010A_N]
U10  SN74LVC2G34DBVR  [DBV0006A_N]  (value not drawn)  (parts A,B,C of 3)
U11  SN74LV4053APWR  [PW0016A-MFG]
U13  SN74LVC8T245PW  [PW0024A_N]
U14  SN74LV4053APWR  [PW0016A-MFG]
Y2  ECS-200-8-30B-CKM  [FP-ECS-200-8-30B-CKM_SMD4-MFG]  (value not drawn)

### Blocks framed on the sheet
UART Routing: C43 C45 C46 S2 U6 U8 U9
Oscillator: C41 C42 R32 R33 R36 R37 Y2
User LEDs: C44 LED4 LED5 R28-R31 R34 R35 U7
Selected Boot Mode Chart: R38 R39 S3
CAN Routing: S4
PWM DAC: C47-C49 R40-R43 U10
EQEP Routing: S5 U11 U14
EQEP Level Shifter: C64 C65 C67 R47 R48 R52 R53 U13
FSI Routing: R44-R46 R49-R51 R54-R56 R81

### Nets
+3V3: C43.1 C44.2 C45.1 C46.2 C49.2 C64.1 R28.2 R29.2 R30.2 R31.2 R47.2 R48.2 S2.1 S2.4 S3.3 S3.6 S5.3 S5.6 U6.8(V+) U7.5(VCC) U8.8(V+) U9.8(V+) U10.5(VCC) U11.16(VCC) U13.1(VCCA) U14.16(VCC)
+5V0: C65.2 C67.1 U13.23(VCCB) U13.24(VCCB)
GND: C41.2 C42.2 C43.2 C44.1 C45.2 C46.1 C47.2 C48.2 C49.1 C64.2 C65.1 C67.2 R52.1 R53.2 S2.3 S2.6 S3.1 S3.4 S5.1 S5.4 U6.3(GND) U7.2(GND) U8.3(GND) U9.3(GND) U10.2(GND) U11.6(INH) U11.7(GND) U11.8(GND) U13.9(A7) U13.10(A8) U13.11(GND) U13.12(GND) U13.13(GND) U13.14(B8) U13.15(B7) U14.6(INH) U14.7(GND) U14.8(GND) Y2.2(Gnd) Y2.4(Gnd)
EQEP1A: U13.21(B1)
EQEP1B: U13.20(B2)
EQEP1I: U13.19(B3)
EQEP2A: U13.18(B4)
EQEP2B: U13.17(B5)
EQEP2I: U13.16(B6)
GPIO1: R56.2
GPIO6_BP: R49.2
GPIO6_FSITXD0: R49.1
GPIO7_BP: R45.2
GPIO7_FSITXCLK: R45.1
GPIO8: R46.2
GPIO10: R81.2
GPIO12_BP: R50.2
GPIO12_FSIRXD0: R50.1 R51.1
GPIO13_BP: R44.2
GPIO13_FSIRXCLK: R44.1 R46.1
GPIO14: U11.14(1-COM)
GPIO14_BP: U11.13(1Y1)
GPIO14_Q2A: U11.12(1Y0) U13.6(A4)
GPIO16: U8.10(COM1)
GPIO16_BP: U8.9(NC1)
GPIO16_SCITX: U8.2(NO1) U9.2(NO1)
GPIO17: U8.6(COM2)
GPIO17_BP: U8.7(NC2)
GPIO17_SCIRX: U8.4(NO2) U9.4(NO2)
GPIO18_BP: R36.1
GPIO18_X2: R32.1 R36.2
GPIO19_BP: R37.1
GPIO19_X1: R33.1 R37.2
GPIO22: R42.1
GPIO22_PWM_DAC: C48.1 R40.2
GPIO23: R43.1
GPIO23_PWM_DAC: C47.1 R41.2
GPIO24: R38.1
GPIO25: U11.15(2-COM)
GPIO25_BP: U11.1(2Y1)
GPIO25_Q2B: U11.2(2Y0) U13.7(A5)
GPIO26: U11.4(3-COM)
GPIO26_BP: U11.3(3Y1)
GPIO26_Q2I: U11.5(3Y0) U13.8(A6)
GPIO28: U6.10(COM1)
GPIO28_BP: U6.2(NO1)
GPIO28_SCIRX: U6.9(NC1) U9.7(NC2)
GPIO29: U6.6(COM2)
GPIO29_BP: U6.4(NO2)
GPIO29_SCITX: U6.7(NC2) U9.9(NC1)
GPIO31: R34.1
GPIO32: R39.2 S4.2
GPIO32_BP: S4.3
GPIO32_CANTX: S4.1
GPIO33: S4.5
GPIO33_BP: S4.6
GPIO33_CANRX: S4.4
GPIO34: R35.1
GPIO37: U14.15(2-COM)
GPIO37_BP: U14.1(2Y1)
GPIO37_Q1B: U13.4(A2) U14.2(2Y0)
GPIO41_BP: R55.2
GPIO41_FSIRXD1: R55.1 R56.1
GPIO43: U14.4(3-COM)
GPIO43_BP: U14.3(3Y1)
GPIO43_Q1I: U13.5(A3) U14.5(3Y0)
GPIO44: U14.14(1-COM)
GPIO44_BP: U14.13(1Y1)
GPIO44_Q1A: U13.3(A1) U14.12(1Y0)
GPIO46_BP: R54.2
GPIO46_FSITXD1: R54.1
MCU_RXD: U9.6(COM2)
MCU_TXD: U9.10(COM1)
QEP1_SEL: S5.5(C) U14.9(C) U14.10(B) U14.11(A)
QEP2_SEL: S5.2(C) U11.9(C) U11.10(B) U11.11(A)
SCI_SEL1: S2.2(C) U6.1(IN1) U6.5(IN2) U9.1(IN1) U9.5(IN2)
SCI_SEL2: S2.5(C) U8.1(IN1) U8.5(IN2)
XTAL_X1: C42.1 R33.2 Y2.3(Out/In)
XTAL_X2: C41.1 R32.2 Y2.1(In/Out)
NetLED4_1: LED4.1(K) U7.6(1Y)
NetLED4_2: LED4.2(A) R28.1
NetLED5_1: LED5.1(A) R29.1
NetLED5_2: LED5.2(K) U7.4(2Y)
NetR30_1: R30.1 R34.2 U7.1(1A)
NetR31_1: R31.1 R35.2 U7.3(2A)
NetR38_2: R38.2 S3.5(C)
NetR39_1: R39.1 S3.2(C)
NetR40_1: R40.1 U10.6(1Y)
NetR41_1: R41.1 U10.4(2Y)
NetR42_2: R42.2 U10.1(1A)
NetR43_2: R43.2 U10.3(2A)
NetR47_1: R47.1 R52.2 U13.2(DIR)
NetR48_1: R48.1 R53.1 U13.22(~{OE})
NetR51_2: R51.2 R81.1

### Layout directives
net class FSIRX: GPIO12_FSIRXD0, GPIO13_FSIRXCLK, GPIO41_FSIRXD1
net class FSITX: GPIO6_FSITXD0, GPIO7_FSITXCLK, GPIO46_FSITXD1

### Notes on the sheet
- SCI_SEL1
- SCI_SEL2
- GPIO28/29 Route
- GPIO16/17 Route
- 0
- 1
- XDS110 COM Port
- BP
- NC
- - DEFAULT
- (near Y2) Route cleanly and place near U1
- (near U6) 1
- - J1
- (near S2) SPDT
- J6 -
- J1 -
- J2 -
- - J4
- - J8
- Boot Mode Select
- By default:
  - Crystal Y2 is connected between  GPIO18_X2 and
  GPIO19_X1.
  - GPIO18_BP AND GPIO19_BP are  connected to the
  BoosterPack  headers.
  If GPIO18 and GPIO 19 are needed at the Boosterpack
  Headers:
  - Remove R32 and R33, populate R36 and R37 with 0 ohm
  resistors
  - The F28002x device's internal oscillator will need to be used
- J5 -
- (near S3) SPDT
- - J6
- (near S4) DPDT
- Mode #
- 00
- GPIO24
- GPIO32
- Boot Mode
- Boot from Parallel GPIO
- 01
- 02
- 03
- Boot from SCI / Wait Mode
- Boot from CAN
- Boot from Flash
- (near S5) SPDT
- (near R81) - J8
- J12
- J13
- - J5
- S5 (1, UP): QEP signals are routed to the BoosterPack Headers (default)
  S5 (0, DOWN): QEP signals are routed to the QEP Headers
- (near U13) DIR pin tied low through R52 by default for B to A direction.
- If needed, depopulate the resistors to isolate the BP headers from the FSI Headers. By default all are populated.
  FSI routing will be as clean as possible to FSI header. BP resistors will be branches with short stubs off of main branch to reduce noise on high speed lines
- To disable the Level Shifter:
  1. De-populate R53
  2. Place a 2.2k ohm resistor on R48 to pull-up OE
- Drawn By:
- SVN Rev:
- Number:
- TID #:
- Orderable:
- Rev:
- Sheet Title:
- File:
- Project Title:
- Designed for:
- Assembly Variant:
- Mod. Date:
- Sheet:
- Size:
- of
- B
- http://www.ti.com
- Texas Instruments and/or its licensors do not warrant the accuracy or completeness of this specification or any information contained therein. Texas Instruments and/or its licensors do not warrant that this design will meet the specifications, will be suitable for your application or fit for any particular purpose, or will operate in an implementation. Texas Instruments and/or its licensors do not warrant that the design is production worthy. You should completely validate and test your design implementation to confirm the system functionality for your application.
- Engineer:
- Contact:
- © Texas Instruments

### Library data of the parts
C41 C42 = CMP-0006239-2: CAP, CERM, 12 pF, 25 V, +/- 5%, C0G/NP0, AEC-Q200 Grade 1, 0402; Manufacturer: Kemet; TaMin_C: -55°C; Polarized: N; SizeAreaWB_mm2: 3; Value1: Unknown; U/M: EA; Value: 12pF; TaMax_C: 125°C; SizeZ_mm: 0.6; SizeX_mm: 1; SizeY_mm: 0.5; Value2: 25V; AEC Qualified: Y; AEC Category: Q200; Supplier Part Number 2: 86T2558; Publisher: Texas Instruments; Supplier 2: Newark; Supplier Part Number 3: 80-C0402C120J3GAUTO; TempCo: C0G/NP0; Supplier 3: Mouser; Published: 2008-06-19; RoHS: Y; MountType: SMT; Supplier 1: Digi-Key; PackageReference: 0402; Tolerance_%: 5%; Cap_Case: 0402; SizeArea_mm2: 0.5; CompType: Capacitor; LatestRevisionDate: 2017-03-09; PartNumber: C0402C120J3GACAUTO; Cap_F: 12pF; VDC_V: 25V; ComponentLink1Description: Datasheet link; AEC Grade: 1; Supplier Part Number 1: 399-6829-1-ND; Technology: Ceramic; ComponentLink1URL: http://www.kemet.com/Lists/ProductCatalog/Attachments/420/KEM_C1022_C0G_AUTO_SMD.pdf
C43-C46 C49 C64 C65 = CMP-0006629-2: as C74 on sheet MCU089B_Connectors; CompType: Capacitor; PartNumber: GRM155R71A104KA01D; PackageReference: 0402; RoHS: Y; Tolerance_%: 10%; Value2: 10V; MountType: SMT; Technology: Ceramic; TempCo: X7R; Cap_Case: 0402; SizeY_mm: 0.5; Published: 2008-06-19; Publisher: Texas Instruments; LatestRevisionDate: 2017-03-09; ComponentLink1Description: Datasheet link; ComponentLink1URL: http://search.murata.co.jp/Ceramy/PnsearchViewAction.do?HnOFG=ON&HnNFG=ON&SEL_CNT=50&sLang=en&sKey=GRM155R71A104KA01D&x=9&y=9&search=startwith; Supplier 1: Digi-Key; Supplier Part Number 1: GRM155R71A104KA01D-ND; Supplier 2: Newark; Supplier Part Number 2: 14T3278; Supplier 3: Mouser; Supplier Part Number 3: 81-GRM155R71A104KA1D; AEC Qualified: ?
C47 C48 = CMP-0006720-2: CAP, CERM, 0.1 uF, 25 V, +/- 20%, X7R, 0402; Manufacturer: Taiyo Yuden; TaMin_C: -55°C; Polarized: N; SizeAreaWB_mm2: 3; Value1: Unknown; U/M: EA; Value: 0.1uF; TaMax_C: 125°C; SizeZ_mm: 0.6; SizeX_mm: 1; SizeY_mm: 0.5; Value2: 25V; Cap_F: 100nF; AEC Category: Q200; Publisher: Texas Instruments; TempCo: X7R; Published: 2008-06-19; RoHS: Y; MountType: SMT; PackageReference: 0402; Tolerance_%: 20%; Cap_Case: 0402; SizeArea_mm2: 0.5; CompType: Capacitor; LatestRevisionDate: 2017-03-09; PartNumber: TMK105B7104MV-FR; AEC Qualified: N; VDC_V: 25V; ComponentLink1Description: Datasheet link; AEC Grade: N/A; Technology: Ceramic; ComponentLink1URL: http://www.yuden.co.jp/productdata/catalog/en/mlcc_all_e.pdf
C67 = CMP-0006231-2: as C68 on sheet MCU089B_Connectors; CompType: Capacitor; PartNumber: 885012205061; PackageReference: 0402; RoHS: Y; Tolerance_%: 10%; Value2: 50V; MountType: SMT; Technology: Ceramic; TempCo: X7R; Cap_Case: 0402; SizeY_mm: 0.5; Published: 2008-06-19; Publisher: Texas Instruments; LatestRevisionDate: 2017-03-09; ComponentLink1Description: Datasheet link; ComponentLink1URL: http://katalog.we-online.de/pbs/datasheet/885012205061.pdf; Supplier 1: Digi-Key; Supplier Part Number 1: 732-7556-1-ND; Supplier 2: Mouser; Supplier Part Number 2: 710-885012205061; AEC Qualified: N; AEC Grade: N/A
LED4 = CMP-0002951-3: LED, Red, SMD; Manufacturer: Wurth Elektronik; Type: AlInGaP; Vf_V: 1.9V; Io_A: 30mA; Vr_V: 5V; Ir_A: 25µA; Tjmax_C: 85°C; Power_TotalModule: 72mW; Value1: 0.072W; Angle: 140; CompType: LED; PartNumber: 150080SS75000; MountType: SMT; RoHS: Y; PackageReference: LED_0805; Value2: 1.9V; Color: Red; ComponentLink1URL: http://katalog.we-online.de/led/datasheet/150080SS75000.pdf; ComponentLink1Description: Datasheet link
LED5 = CMP-0002830-3: LED, Green, SMD; Manufacturer: Lite-On; Type: AlInGaP; Vf_V: 2.1V; Io_A: 20A; Value1: W; SizeAreaWB_mm2: 6.75; SizeArea_mm2: 2.5; SizeX_mm: 2; SizeY_mm: 1.25; SizeZ_mm: 1.2; CompType: LED; PartNumber: LTST-C171GKT; MountType: SMT; RoHS: Y; PackageReference: 0805 LED; Value2: 2.1V; Color: green; ComponentLink1URL: https://sps06.itg.ti.com/sites/KMS/crossdivteams/altium/docs/ComponentDatasheets/LTST-C171GKT.pdf; ComponentLink1Description: Datasheet link
R28 R29 = CMP-0026962-3: RES, 680, 5%, 0.063 W, AEC-Q200 Grade 0, 0402; Manufacturer: Vishay-Dale; Power_W: 63mW; TempCo: 200 ppm/C; Value_Code: 680R; Value: 680; EIA_Code: E24; SizeX_mm: 1; SizeY_mm: 0.5; SizeZ_mm: 0.6; Value2: 0.063W; CompType: Resistor; AEC Qualified: Y; VDC_V: 50V; AEC Category: Q200; AEC Grade: 0; Supplier Part Number 2: 59M6744; Supplier 2: Newark; Supplier Part Number 3: 71-CRCW0402J-680-E3; Supplier 3: Mouser; RoHS: E; Value1: 5%; MountType: SMT; Supplier 1: Digi-Key; PackageReference: 0402; Tolerance_%: 5%; Res_ohm: 680; SizeArea_mm2: 0.5; PartNumber: CRCW0402680RJNED; ComponentLink1Description: Datasheet link; Supplier Part Number 1: 541-680JCT-ND; Technology: Thick Film; ComponentLink1URL: http://www.vishay.com/docs/20035/dcrcwe3.pdf
R30 R31 = CMP-0026826-2: RES, 10 M, 5%, 0.063 W, AEC-Q200 Grade 0, 0402; Manufacturer: Vishay-Dale; Value: 10Meg; Value_Code: 10M0; Power_W: 63mW; Value2: 0.063W; VDC_V: 50V; TempCo: 200 ppm/C; SizeArea_mm2: 0.5; SizeX_mm: 1; SizeZ_mm: 0.6; EIA_Code: E24; AEC Category: Q200; AEC Qualified: Y; AEC Grade: 0; CompType: Resistor; PartNumber: CRCW040210M0JNED; PackageReference: 0402; RoHS: E; Res_ohm: 10M; Tolerance_%: 5%; Value1: 5%; MountType: SMT; Technology: Thick Film; SizeY_mm: 0.5; ComponentLink1Description: Datasheet link; ComponentLink1URL: http://www.vishay.com/docs/20035/dcrcwe3.pdf; Supplier 1: Digi-Key; Supplier Part Number 1: 541-10MJCT-ND; Supplier 2: Newark; Supplier Part Number 2: 59M6697; Supplier 3: Mouser; Supplier Part Number 3: 71-CRCW0402J-10M-E3
R32-R37 R42-R47 R49-R56 R81 = CMP-0025697-4: as R69 on sheet MCU089B_Connectors; CompType: Resistor; PartNumber: CRCW06030000Z0EA; PackageReference: 0603; RoHS: E; Res_ohm: 0; Tolerance_%: 5%; Value1: 5%; MountType: SMT; Technology: Thick Film; ComponentLink1Description: Datasheet link; ComponentLink1URL: http://www.vishay.com/docs/20035/dcrcwe3.pdf; Supplier 1: Digi-Key; Supplier Part Number 1: 541-0.0GCT-ND; Supplier 2: Newark; Supplier Part Number 2: 52K8014; Supplier 3: Mouser; Supplier Part Number 3: 71-CRCW0603-0-E3; AEC Grade: 0
R38 R39 = CMP-0022746-5: RES, 10.0 k, 1%, 0.1 W, 0603; Manufacturer: Yageo; Power_W: 100mW; TempCo: 100 ppm/C; Value_Code: 10k0; Value: 10.0k; EIA_Code: E96; Res_ohm: 10k; SizeX_mm: 1.6; SizeY_mm: 0.8; SizeZ_mm: 1; Value2: 0.1W; SizeArea_mm2: 1.28; AEC Qualified: N; VDC_V: 75V; AEC Category: Q200; SizeAreaWB_mm2: 4.68; Supplier Part Number 2: 603-RC0603FR-0710KL; Supplier 2: Mouser; Supplier Part Number 3: 9238603; Supplier 3: Farnell; RoHS: Y; Value1: 1%; MountType: SMT; Supplier 1: Digi-Key; PackageReference: 0603; Tolerance_%: 1%; CompType: Resistor; PartNumber: RC0603FR-0710KL; ComponentLink1Description: Datasheet link; Supplier Part Number 1: 311-10.0KHRCT-ND; Technology: Thick Film; ComponentLink1URL: http://www.yageo.com/pdf/Pu-RC0603_51_PbFree_L_2.pdf; AEC Grade: N/A
R40 R41 = CMP-0026071-3: RES, 1.00 k, 1%, 0.063 W, AEC-Q200 Grade 0, 0402; Manufacturer: Vishay-Dale; Power_W: 63mW; TempCo: 100 ppm/C; Value_Code: 1k00; Value: 1.00k; EIA_Code: E96; Res_ohm: 1k; SizeX_mm: 1; SizeY_mm: 0.5; SizeZ_mm: 0.6; Value2: 0.063W; AEC Qualified: Y; VDC_V: 50V; AEC Category: Q200; AEC Grade: 0; Supplier Part Number 2: 52K6545; Supplier 2: Newark; Supplier Part Number 3: 71-CRCW0402-1.0K-E3; Supplier 3: Mouser; RoHS: E; Value1: 1%; MountType: SMT; Supplier 1: Digi-Key; PackageReference: 0402; Tolerance_%: 1%; SizeArea_mm2: 0.5; CompType: Resistor; PartNumber: CRCW04021K00FKED; ComponentLink1Description: Datasheet link; Supplier Part Number 1: 541-1.00KLCT-ND; Technology: Thick Film; ComponentLink1URL: http://www.vishay.com/docs/20035/dcrcwe3.pdf
R48 = CMP-0025769-4: RES, 2.2 k, 5%, 0.1 W, AEC-Q200 Grade 0, 0603; Manufacturer: Vishay-Dale; Value: 2.2k; Value_Code: 2k20; Power_W: 100mW; Value2: 0.1W; VDC_V: 75V; TempCo: 200 ppm/C; SizeArea_mm2: 1.28; SizeX_mm: 1.6; SizeY_mm: 0.8; SizeZ_mm: 1; EIA_Code: E24; AEC Category: Q200; AEC Qualified: Y; AEC Grade: 0; CompType: Resistor; PartNumber: CRCW06032K20JNEA; PackageReference: 0603; RoHS: E; Res_ohm: 2.2k; Tolerance_%: 5%; Value1: 5%; MountType: SMT; Technology: Thick Film; ComponentLink1Description: Datasheet link; ComponentLink1URL: http://www.vishay.com/docs/20035/dcrcwe3.pdf; Supplier 1: Digi-Key; Supplier Part Number 1: 541-2.2KGCT-ND; Supplier 2: Newark; Supplier Part Number 2: 59M6776; Supplier 3: Farnell; Supplier Part Number 3: 1652868
S2 S5 = CMP-0002233-1: Switch, Dual SPDT,  2 Pos, 0.1A, 6VDC, SMD; Manufacturer: Copal Electronics; VDC_V: 6V; SwitchFunction: On-On; PositionCount: 2; CurrentRating_mA: 100A; PartNumber: CAS-D20TA; MountType: SMT; ComponentLink1Description: Datasheet Link; ComponentLink1URL: http://www.nidec-copal-electronics.com/e/catalog/switch/cas.pdf; RoHS: Y; Circuit: SPDT; Orientation: Top Actuated; CompType: Switch; PackageReference: 5.4x3.9mm; Publisher: Texas Instruments; LatestRevisionDate: 2017-03-09; Supplier 1: Digi-Key; Supplier Part Number 1: CASD20JCT-ND
S3 = CMP-0002233-1: Switch, Dual SPDT,  2 Pos, 0.1A, 6VDC, SMD; Manufacturer: Copal Electronics; CurrentRating_mA: 100A; SwitchFunction: On-On; VDC_V: 6V; PositionCount: 2; ComponentLink1Description: Datasheet Link; LatestRevisionDate: 2017-03-09; PackageReference: 5.4x3.9mm; Publisher: Texas Instruments; Supplier 1: Digi-Key; ComponentLink1URL: http://www.nidec-copal-electronics.com/e/catalog/switch/cas.pdf; Supplier Part Number 1: CASD20JCT-ND; MountType: SMT; Circuit: SPDT; Orientation: Top Actuated; PartNumber: CAS-D20TA; CompType: Switch; RoHS: Y
S4 = CMP-0002123-2: SLIDE SWITCH DPDT  .1A, SMT; Manufacturer: Copal Electronics; VDC_V: 6V; SwitchFunction: On-On; PositionCount: 2; CurrentRating_mA: 100A; PartNumber: CAS-220TA; MountType: SMT; ComponentLink1Description: Datasheet URL; ComponentLink1URL: http://copal-electronics.info/en/0008e/02462.pdf; RoHS: Y; Circuit: DPDT; Orientation: Horizontal; CompType: Switch; PackageReference: SWITCH, 5.4x2.5x3.9mm; Publisher: Texas Instruments; LatestRevisionDate: 2017-03-09; Supplier 1: Digi-Key; Supplier Part Number 1: CAS220JCT-ND
U6 U8 U9 = CMP-0067418-1: DUAL 10-Ohm SPDT ANALOG SWITCH, DGS0010A (VSSOP-10); Alternate PartNumber: TS5A23157DGST; Alternate Manufacturer: Texas Instruments; Green_Lifecycle: Active; SizeAreaWB_mm2: 23.6; Green_REACh: Passed; U/M: EA; SizeZ_mm: 1.1; SizeX_mm: 4.9; SizeY_mm: 3.0; SizeArea_mm2: 14.7; CompType: IC; ComponentLink1URL: http://www.ti.com/lit/ds/symlink/ts5a23157.pdf; Publisher: Texas Instruments; PackageDescription: VSSOP-10; RoHS: Y; Footprint Path 6: C:\AltiumLibraries\Footprints\TI\.PcbLib; MountType: SMT; Green_EU RoHS-2: Passed; Manufacturer: Texas Instruments; Green_EU RoHS: Passed; PackageReference: DGS0010A; LatestRevisionDate: 2017-06-09; PartNumber: TS5A23157DGSR; ComponentLink1Description: Datasheet Link
U7 = CMP-0051789-2: Dual Buffer/Driver with Open-Drain Output, DBV0006A, LARGE T&R; Manufacturer: Texas Instruments; VCC(Min)(V): 1.65; VCC(Max)(V): 5.5; Output Type: CMOS; ICC @ Nom Voltage(Max)(mA): 0.01; Input Type: CMOS/TTL; Bits(#): 2; F @ Nom Voltage(Max)(Mhz): 150; Rating: Catalog; Technology Family: LVC; Voltage(Nom)(V): 1.8,2.5,3.3,5; Schmitt Trigger: No; Output Drive (IOL/IOH)(Max)(mA): 32/-32; tpd @ Nom Voltage(Max)(ns): 8.6,4.4,3.7,2.9; Logic: True; Sub-Family: Inverting Buffer/Driver; AEC Category: Q200; AEC Qualified: N; CompType: IC; Green_Lifecycle: Active; Green_REACh: Passed; SizeArea_mm2: 8.12; SizeAreaWB_mm2: 14.82; SizeX_mm: 2.8; SizeY_mm: 2.9; SizeZ_mm: 1.45; DatasheetVersion: SCES308K; PackageReference: DBV0006A; Generic Part Number: SN74LVC2G07; Operating Temperature Range(C): -40 to 125; 3-State Output: No; ComponentLink1Description: Datasheet Link; ComponentLink1URL: http://www.ti.com/lit/ds/symlink/sn74lvc2g07.pdf; ComponentLink2Description: Product Folder; ComponentLink2URL: http://www.ti.com/product/sn74lvc2g07; ComponentLink3Description: Online Datasheet; ComponentLink3URL: http://www.ti.com/product/sn74lvc2g07/datasheet; Green_EU RoHS-2: Passed; Green_EU RoHS: Passed; MountType: SMT; PackageDescription: SOT-23-6; PartNumber: SN74LVC2G07DBVR; RoHS: Y
U10 = CMP-0051910-1: Dual Buffer Gate, DBV0006A, LARGE T&R; Manufacturer: Texas Instruments; Logic: True; F @ Nom Voltage(Max)(Mhz): 150; Output Type: CMOS; Output Drive (IOL/IOH)(Max)(mA): 32/-32; Voltage(Nom)(V): 1.8,2.5,3.3,5; 3-State Output: No; VCC(Max)(V): 5.5; ICC @ Nom Voltage(Max)(mA): 0.01; Technology Family: LVC; Input Type: CMOS/TTL; VCC(Min)(V): 1.65; Bits(#): 2; tpd @ Nom Voltage(Max)(ns): 8.6,4.4,4.1,3.2; Rating: Catalog; Sub-Family: Non-Inverting Buffer/Driver; Generic Part Number: SN74LVC2G34; Operating Temperature Range(C): -40 to 125,-40 to 85; DatasheetVersion: SCES359I; Schmitt Trigger: No; PackageReference: DBV0006A
U11 U14 = CMP-0089841-1: 3 Circuit IC Switch 2:1 75Ohm 16-TSSOP; Manufacturer: Texas Instruments; TaMax_C: +85°C; Max Supply Voltage: 5.5V; PositionCount: 3; AEC Qualified: No; SizeZ_mm: 1.2mm; Standoff Height: 0.05mm; On State Resistance: 100-225Ω; Min Supply Voltage: 2V; -3Db Bandwith: 50MHz; Nominal Supply Current: 20uA; TaMin_C: -40°C; Lead Free: Yes; Operating Temperature Range: -40°C to +85°C; Mux Demux Ratio: 2:1; ComponentLink1Description: Datasheet; Part Number: SN74LV4053APWR; Digikey Description: IC MUX/DEMUX TRIPLE 2X1 16TSSOP; ComponentLink1URL: https://upverter.com/datasheet/3a9d815208c4051a64f1f6fd539a8c5a24990e71.pdf; PartNumber: SN74LV4053APWR; Mouser Description: Multiplexer Switch ICs Triple 2-Ch Analog; Mouser Part Number: 595-SN74LV4053APWR; RoHS: TRUE; PackageReference: TSSOP16; helpURL: https://upverter.com/upn/revision/43c5e7c12a31b2aa/; datasheet: https://upverter.com/datasheet/3a9d815208c4051a64f1f6fd539a8c5a24990e71.pdf; Digikey Part Number: 296-3833-1-ND; Datasheet Path: datasheets/IC-SN74LV4053APWR.pdf
U13 = CMP-0066458-2: 8-Bit Dual-Supply Bus Transceiver with Configurable Voltage-Level Shifting and Three-State Outputs, PW0024A (TSSOP-24); Alternate Manufacturer: Texas Instruments; SizeAreaWB_mm2: 82.32; SizeZ_mm: 1.2; SizeX_mm: 6.4; SizeY_mm: 7.8; SizeArea_mm2: 49.92; CompType: IC; AEC Category: Q200; AEC Qualified: N; Rating: Catalog; ComponentLink1URL: http://www.ti.com/lit/ds/symlink/sn74lvc8t245.pdf; PackageDescription: TSSOP-24; RoHS: Y; MountType: SMT; Manufacturer: Texas Instruments; PackageReference: PW0024A; PartNumber: SN74LVC8T245PW; ComponentLink1Description: Datasheet Link; ComponentLink2Description: Product Folder; ComponentLink2URL: http://www.ti.com/product/sn74lvc8t245; ComponentLink3Description: Online Datasheet; ComponentLink3URL: http://www.ti.com/product/sn74lvc8t245/datasheet; Operating Temperature Range: -40 to 85 C
Y2 = CMP-0093370-1: 20 MHz ±10ppm Crystal 8pF 40 Ohms 4-SMD, No Lead; Manufacturer: ECS International; Frequency_Fixed: 20MHz; Esr: 40; SizeZ_mm: 0.85mm; Datasheet Path: datasheets/Crys-ECS-200-8-30B-CKM.pdf; ComponentLink1URL: https://ecsxtal.com/store/pdf/ecx_53b.pdf; Supplier Part Number 1: XC1841CT-ND; Operating Temperature Range: -20°C to +70°C; Tolerance_%: 10ppm; PartNumber: ECS-200-8-30B-CKM; PackageReference: SMD4; Mouser Part Number: 520-200-8-30B-CKM; ComponentLink1Description: Datasheet; Part Number: ECS-200-8-30B-CKM; Digikey Description: CRYSTAL 20.0000MHZ 8PF SMD; AEC Qualified: No; Load Capacitance: 8pF; Supplier 2: Mouser; Mouser Description: Crystals 20.000MHZ 8pF 10ppm -20C +70C; Supplier 1: Digikey; Frequency Stability: 10ppm; datasheet: https://ecsxtal.com/store/pdf/ecx_53b.pdf; Frequency Tolerance: 10ppm; Digikey Part Number: XC1841CT-ND; Lead Free: Yes; helpURL: https://upverter.com/upn/revision/b9ae4a09c701963d/; RoHS: TRUE; Series: ECX-53B; Supplier Part Number 2: 520-200-8-30B-CKM